# Altium schematic sheet WIFI.SchDoc
size A3; SheetNumber: 7; SheetTotal: 10
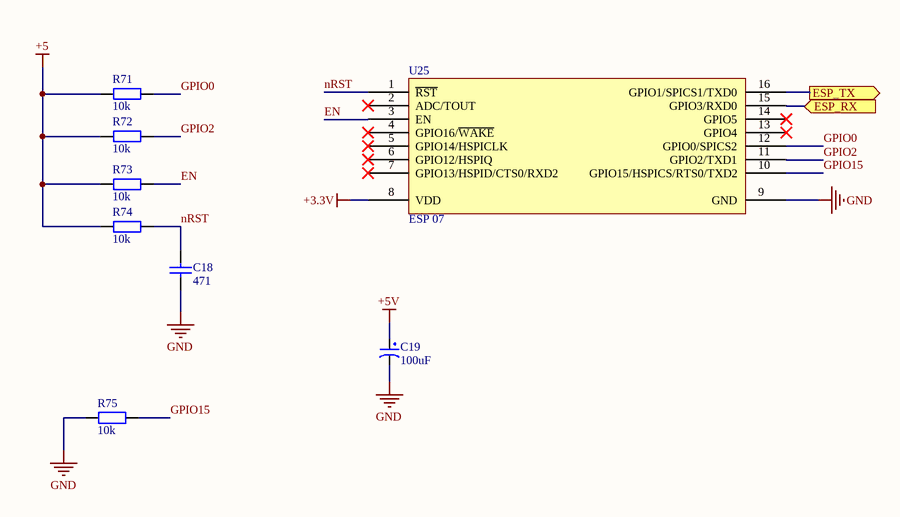
[diagram p0: WIFI.SchDoc]

## Parts
C18  471  [tu 0805]
C19  100uF  [tu hoa 5mm]
R71  10k  [tro smd 0805]
R72  10k  [tro smd 0805]
R73  10k  [tro smd 0805]
R74  10k  [tro smd 0805]
R75  10k  [tro smd 0805]
U25  ESP 07  [ESP8266 07]

## Ports
ESP_RX (in), ESP_TX (out)

## Nets
+3.3V: U25.8(VDD)
+5: R71.2 R72.2 R73.2 R74.2
+5V: C19.1
GND: C18.2 C19.2 R75.2 U25.9(GND)
EN: R73.1 U25.3(EN)
ESP_RX: U25.15(GPIO3/RXD0) ; port ESP_RX
ESP_TX: U25.16(GPIO1/SPICS1/TXD0) ; port ESP_TX
GPIO0: R71.1 U25.12(GPIO0/SPICS2)
GPIO2: R72.1 U25.11(GPIO2/TXD1)
GPIO15: R75.1 U25.10(GPIO15/HSPICS/RTS0/TXD2)
nRST: C18.1 R74.1 U25.1(~{RST})

Not connected (* = marked no-connect by the designer): U25 2(ADC/TOUT)* 4(GPIO16/~{WAKE})* 5(GPIO14/HSPICLK)* 6(GPIO12/HSPIQ)* 7(GPIO13/HSPID/CTS0/RXD2)* 13(GPIO4)* 14(GPIO5)*

## Library data of the parts
C18 = Tu 0805 471 50V 10%: Dán; Don_Vi: Con; So_Chan: 2; Ten_Linh_Kien: Tụ 0805 471-470 10% 50V; Ma_Hang: MH004564; Chung_Loai: Dán; Kieu_Chan: *
C19 = Tu Hoa 100uF 16V 5x7: Cắm; Don_Vi: Con; So_Chan: 2; Ten_Linh_Kien: Tụ Hóa 100uF 16V 5x7MM; Ma_Hang: MH001347; Chung_Loai: Cắm; Kieu_Chan: *
R71-R75 = Tro 0805 1% 10k: Dán; Don_Vi: Con; So_Chan: 2; Ten_Linh_Kien: Trở 0805 1% 10k; Ma_Hang: MH005473; Chung_Loai: Dán; Kieu_Chan: *
U25 = ESP8266 07: ESP8266 07 16 Pin; IC: ESP8266-EX; Vendor: Ai-thinker